# EAGLE design BMS_Rev2_power (EAGLE 7.0.0)
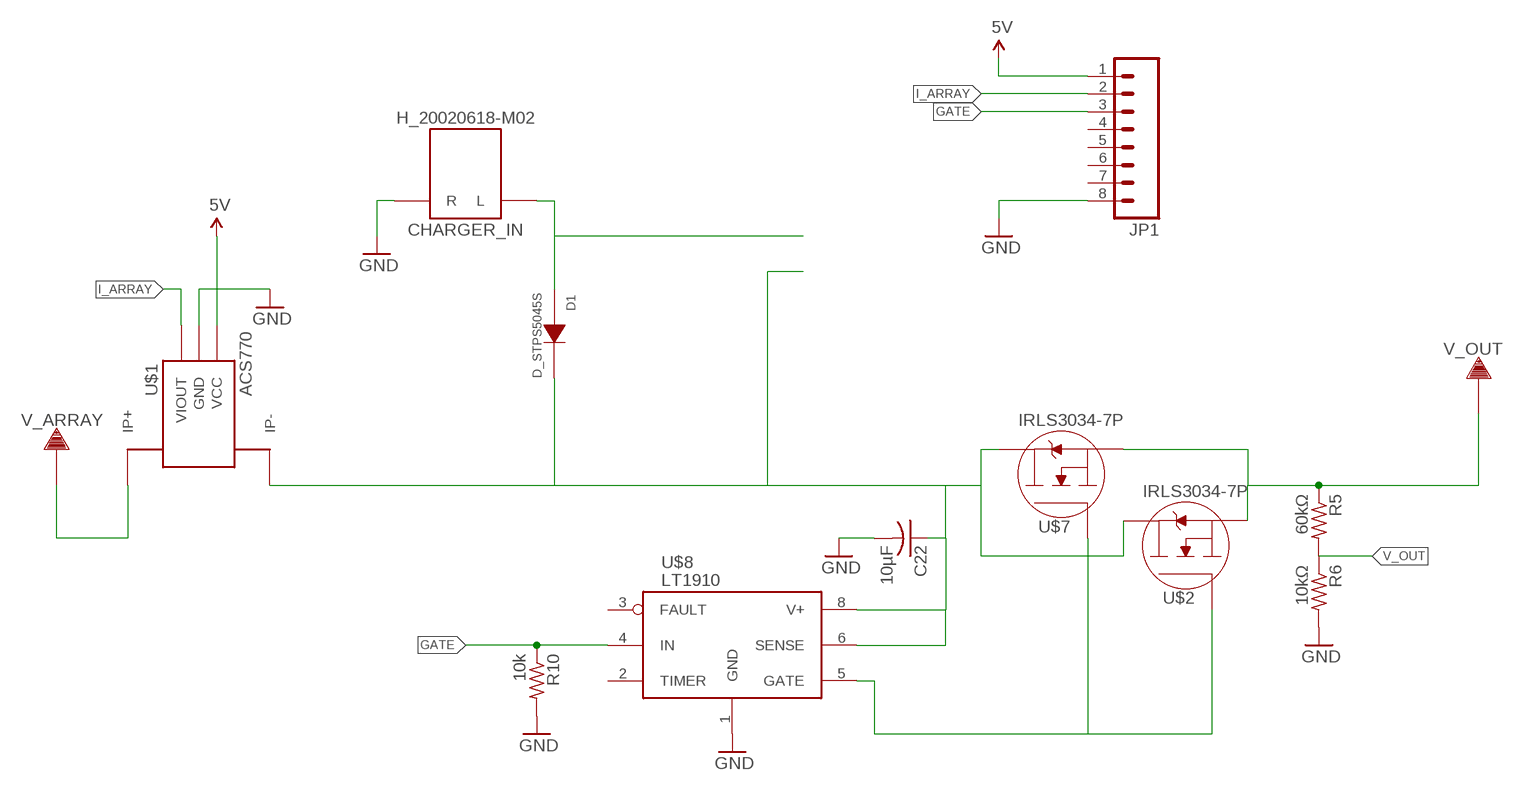
[diagram p0: schematic, sheet 1]

## Parts
C22  10µF  C-USC1206  [C1206]
CHARGER_IN  H_20020618-M02  [20020618-M02]
D1  D_STPS5045S  [D2PACK]
JP1  M08BM08B-SRSS-TB  [BM08B-SRSS-TB]
R5  60kΩ  R-US_R1206  [R1206]
R6  10kΩ  R-US_R1206  [R1206]
R10  10k  R-US_R1206  [R1206]
U$1  ACS770  [PFF_LEADFORM]
U$2  IRLS3034-7P  [D2PAK-7]
U$7  IRLS3034-7P  [D2PAK-7]
U$8  LT1910  [SO8]
V_ARRAY  TERMINAL_HOLE  [LARGE_TERMINAL_HOLE]
V_OUT  TERMINAL_HOLE  [LARGE_TERMINAL_HOLE]

## Nets
5V: JP1.1 U$1.1(VCC)
GATE: JP1.3 R10.1 U$8.4(IN)
GND: C22.2 CHARGER_IN.R1(R) CHARGER_IN.R2(R) JP1.8 R6.2 R10.2 U$1.2(GND) U$8.1(GND)
I_ARRAY: JP1.2 U$1.3(VIOUT)
N$1: R5.1 U$2.2(SOURCE) U$2.3(SOURCE) U$2.4(SOURCE) U$2.5(SOURCE) U$2.6(SOURCE) U$7.2(SOURCE) U$7.3(SOURCE) U$7.4(SOURCE) U$7.5(SOURCE) U$7.6(SOURCE) V_OUT.P$1
N$2: U$1.4_1(IP+) U$1.4_2(IP+) U$1.4_3(IP+) U$1.4_4(IP+) U$1.4_5(IP+) U$1.4_6(IP+) U$1.4_7(IP+) U$1.4_8(IP+) U$1.4_9(IP+) U$1.4_10(IP+) U$1.4_11(IP+) U$1.4_12(IP+) U$1.4_13(IP+) U$1.4_14(IP+) U$1.4_15(IP+) U$1.4_16(IP+) U$1.4_B(IP+) U$1.4_T(IP+) V_ARRAY.P$1
N$3: C22.1 D1.TAB(K) U$1.5_1(IP-) U$1.5_2(IP-) U$1.5_3(IP-) U$1.5_4(IP-) U$1.5_5(IP-) U$1.5_6(IP-) U$1.5_7(IP-) U$1.5_8(IP-) U$1.5_9(IP-) U$1.5_10(IP-) U$1.5_11(IP-) U$1.5_12(IP-) U$1.5_13(IP-) U$1.5_14(IP-) U$1.5_15(IP-) U$1.5_16(IP-) U$1.5_B(IP-) U$1.5_T(IP-) U$2.PAD(DRAIN) U$7.PAD(DRAIN) U$8.6(SENSE) U$8.8(V+)
N$5: U$2.1(GATE) U$7.1(GATE) U$8.5(GATE)
N$8: CHARGER_IN.L1(L) CHARGER_IN.L2(L) D1.1(A) D1.2(A)
V_OUT: R5.2 R6.1
Unconnected: JP1.4 JP1.5 JP1.6 JP1.7 U$8.2(TIMER) U$8.3(FAULT)

## Library data of the parts
C22 = resistor:C-US: CAPACITOR, American symbol
CHARGER_IN = MRDT-2015-PowerBoard:H_20020618-M02*: 20020618-M02* header pin from FCI. Rated up to 32A
D1 = MRDT-2015-BMS:D_STPS5045S
JP1 = SparkFun-Connectors:M08: Header 8 Standard 8-pin 0.1" header. Use with straight break away headers (SKU : PRT-00116), right angle break away headers (PRT-00553), swiss pins (PRT-00743), machine pins (PRT-00117), and female headers (PRT-00115).
R5 R6 R10 = resistor:R-US_: RESISTOR, American symbol
U$1 = MRDT-2015-BMS:ACS770
U$2 U$7 = MRDT-2015-BMS:IRLS3034-7P: High-current SMD MOSFET
U$8 = MRDT-2015-PowerBoard:LT1910
V_ARRAY V_OUT = MRDT-2015-PowerBoard:TERMINAL_HOLE

## Board
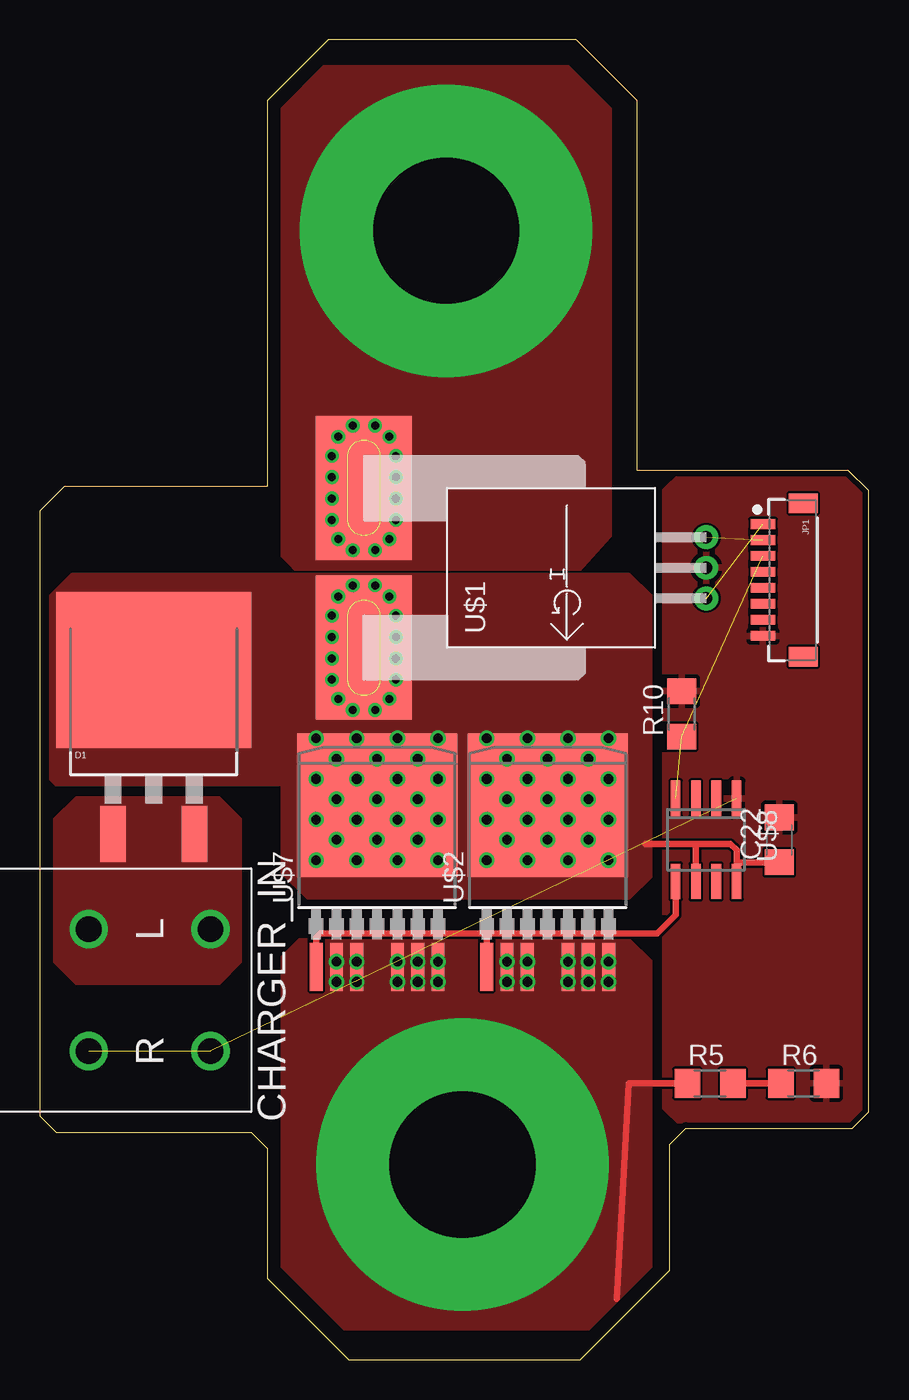
[diagram p1: board, top side]
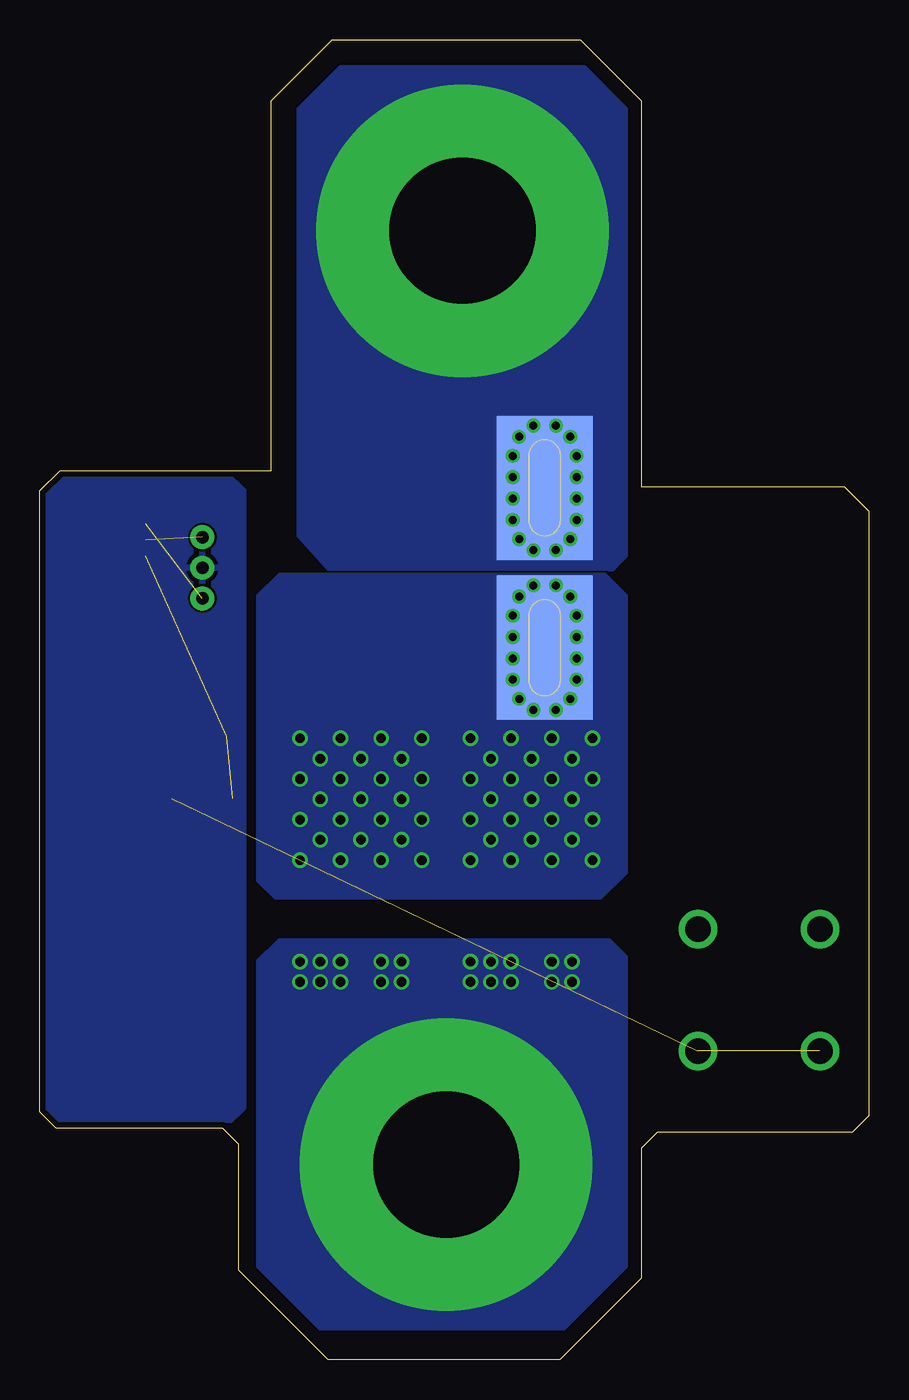
[diagram p2: board, bottom side, seen from below]

Size 51.82 x 82.55 mm. Coordinates in mm from the lower left corner, seen from the top.
Outline: 19.3,0 33.78,0 39.37,5.59 39.37,13.46 40.39,14.48 50.8,14.48 51.82,15.49 51.82,54.36 50.55,55.63 37.34,55.63 37.34,78.74 33.53,82.55 18.03,82.55 14.22,78.74 14.22,54.61 1.52,54.61 0,53.09 0,15.24 1.02,14.22 13.21,14.22 14.22,13.21 14.22,5.08 19.3,0
Copper layers (1*16): Top 0.0356mm / dielectric 1.5011mm / Bottom 0.0356mm
Design rules "OSHPark": minimum track width 6mil, minimum drill 13mil, track to track 6mil, track to pad 6mil, pad to pad 6mil, via to via 6mil, smd to smd 6mil, copper to edge 15mil, drill to drill 6mil, minimum pad ring 7mil, minimum via ring 7mil, stop-mask expansion 3mil, vias tented up to drill 0mil, thermal gap 10mil

### Footprints (pad centres in the part's own frame; a part is rotated, then mirrored left to right if it is on the bottom)
C1206 = smd 1.6 x 1.8: 1 -1.4,0; 2 1.4,0
20020618-M02 = drill 1.6: L1 -3.81,3.81; L2 -3.81,-3.81; R1 3.81,3.81; R2 3.81,-3.81
D2PACK = smd 1.6 x 3.5: 1 -2.54,-8.275; 2 2.54,-8.275 | smd 12.2 x 9.75: TAB 0,2
BM08B-SRSS-TB = smd 0.6 x 1.55: 1 -3.5,0; 2 -2.5,0; 3 -1.5,0; 4 -0.5,0; 5 0.5,0; 6 1.5,0; 7 2.5,0; 8 3.5,0 | smd 1.2 x 1.8: P$9 4.8,2.525; P$10 -4.8,2.525
R1206 = smd 1.6 x 1.803: 1 -1.422,0; 2 1.422,0
PFF_LEADFORM = drill 0.8 pad 1.5: 1 -1.91,0; 2 0,0; 3 1.91,0 | drill 0.5: 4_1 3,23.4; 4_2 4.33,23.4; 4_3 5.67,23.4; 4_4 7,23.4; 4_5 8.2,23; 4_6 8.9,22.1; 4_7 8.9,20.7; 4_8 8.2,19.8; 4_9 7,19.4; 4_10 5.67,19.4; 4_11 4.33,19.4; 4_12 3,19.4; 4_13 1.8,19.8; 4_14 1.1,20.7; 4_15 1.1,22.1; 4_16 1.8,23; 5_1 -7,23.4; 5_2 -5.67,23.4; 5_3 -4.33,23.4; 5_4 -3,23.4; 5_5 -1.8,23; 5_6 -1.1,22.1; 5_7 -1.1,20.7; 5_8 -1.8,19.8; 5_9 -3,19.4; 5_10 -4.33,19.4; 5_11 -5.67,19.4; 5_12 -7,19.4; 5_13 -8.2,19.8; 5_14 -8.9,20.7; 5_15 -8.9,22.1; 5_16 -8.2,23 | smd 9 x 6 bottom: 4_B 5,21.4; 5_B -5,21.4 | smd 9 x 6: 4_T 5,21.4; 5_T -5,21.4
D2PAK-7 = smd 0.8 x 3: 1 -3.81,-9.207; 2 -2.54,-9.207; 3 -1.27,-9.207; 4 1.27,-9.207; 5 2.54,-9.207; 6 3.81,-9.207 | smd 10 x 9: PAD 0,0.895
SO8 = smd 0.6 x 2.2: 1 -1.905,-2.6; 2 -0.635,-2.6; 3 0.635,-2.6; 4 1.905,-2.6; 5 1.905,2.6; 6 0.635,2.6; 7 -0.635,2.6; 8 -1.905,2.6
LARGE_TERMINAL_HOLE = drill 9.144 pad 18.288: P$1 0,0

### Placement (x,y rotation side)
C22  46.23,32.51 90 top
CHARGER_IN  6.86,23.11 270 top
D1  7.11,41.15 0 top
JP1  45.21,48.77 270 top
R5  41.91,17.27 0 top
R6  47.75,17.27 0 top
R10  40.13,40.39 90 top
U$1  41.66,49.53 90 top
U$2  31.75,33.78 0 top
U$7  21.08,33.78 0 top
U$8  41.66,32.51 180 top
V_ARRAY  25.4,70.61 270 top
V_OUT  26.42,12.19 270 top

### Tracks (layer width: path | path; a pad name or v marks a point on that pad's centre or on a via)
5V  (1 unrouted)
GATE  (2 unrouted)
GND  (2 unrouted)
  pour Top (rank 2): 39.12,16 39.12,15.75 40.13,14.73 50.29,14.73 51.56,16 51.56,54.1 50.29,55.37 40.13,55.37 39.12,54.36
  pour Bottom (rank 2): 39.12,54.36 39.12,15.75 40.13,14.73 50.29,14.73 51.56,16 51.56,54.1 50.29,55.37 40.13,55.37
I_ARRAY  (1 unrouted)
N$1  (via drill 0.6)
  Top 0.406: R5.1 36.83,17.27 36.07,3.81
  other vias: 35.56,24.89 35.56,23.62 34.29,24.89 34.29,23.62 33.02,24.89 33.02,23.62 30.48,24.89 30.48,23.62 29.21,24.89 29.21,23.62 24.89,23.62 24.89,24.89 22.35,24.89 23.62,24.89 23.62,23.62 22.35,23.62 19.81,23.62 18.54,23.62 18.54,24.89 19.81,24.89
  pour Top (rank 3, no thermals): 38.1,24.89 38.1,5.84 34.29,2.03 19.05,2.03 15.24,5.84 15.24,25.15 16.26,26.16 36.83,26.16
  pour Bottom (rank 3, no thermals): 38.1,24.89 38.1,5.84 34.29,2.03 19.05,2.03 15.24,5.84 15.24,25.15 16.26,26.16 36.83,26.16
N$2
  pour Top (rank 4, no thermals): 33.02,80.77 17.78,80.77 15.24,78.23 15.24,50.29 16.51,49.02 33.27,49.02 35.56,51.56 35.56,78.23
  pour Bottom (rank 4, no thermals): 17.78,80.77 33.02,80.77 35.56,78.23 35.56,51.56 33.27,49.02 16.51,49.02 15.24,50.29 15.24,78.23
N$3  (via drill 0.6)
  Top 0.406: U$8.6 41.02,32.26 | 41.02,32.26 37.85,32.26 | U$8.8 43.56,30.99 | 43.56,30.99 43.56,31.88 43.18,32.26 41.02,32.26 | C22.1 43.69,31.11 43.56,30.99
  other vias: 27.94,38.86 34.29,37.59 35.56,38.86 33.02,33.78 35.56,36.32 31.75,35.05 30.48,33.78 29.21,32.51 30.48,31.24 27.94,36.32 29.21,35.05 31.75,32.51 35.56,31.24 35.56,33.78 34.29,35.05 34.29,32.51 33.02,38.86 33.02,31.24 29.21,37.59 27.94,31.24 30.48,36.32 27.94,33.78 31.75,37.59 33.02,36.32 30.48,38.86 23.62,37.59 22.35,38.86 19.81,36.32 17.27,38.86 18.54,37.59 21.08,35.05 24.89,36.32 23.62,35.05 23.62,32.51 24.89,38.86 19.81,38.86 21.08,37.59 18.54,35.05 18.54,32.51 19.81,31.24 17.27,36.32 17.27,33.78 19.81,33.78 17.27,31.24 22.35,36.32 22.35,33.78 22.35,31.24 21.08,32.51 24.89,33.78 24.89,31.24
  pour Top (rank 3, no thermals): 36.83,49.02 38.1,47.75 38.1,30.23 36.83,28.96 16.76,28.96 15.24,30.48 15.24,36.07 1.02,36.07 0.76,36.32 0.76,47.75 2.03,49.02
  pour Bottom (rank 3, no thermals): 15.24,47.75 15.24,30.48 16.76,28.96 37.08,28.96 38.1,29.97 38.1,47.75 36.83,49.02 16.51,49.02
N$5
  Top 0.406: U$7.1 17.27,26.42 17.53,26.67 27.94,26.67 | 27.94,26.67 38.61,26.67 39.75,27.81 U$8.5 | U$2.1 27.94,26.67
N$8
  pour Top (no thermals): 12.45,24.89 12.45,33.78 11.18,35.05 2.29,35.05 1.02,33.78 1.02,24.89 2.29,23.62 11.18,23.62
V_OUT
  Top 0.406: R5.2 R6.1